# Altium project MIC23201 Atmel Support.PrjPcb
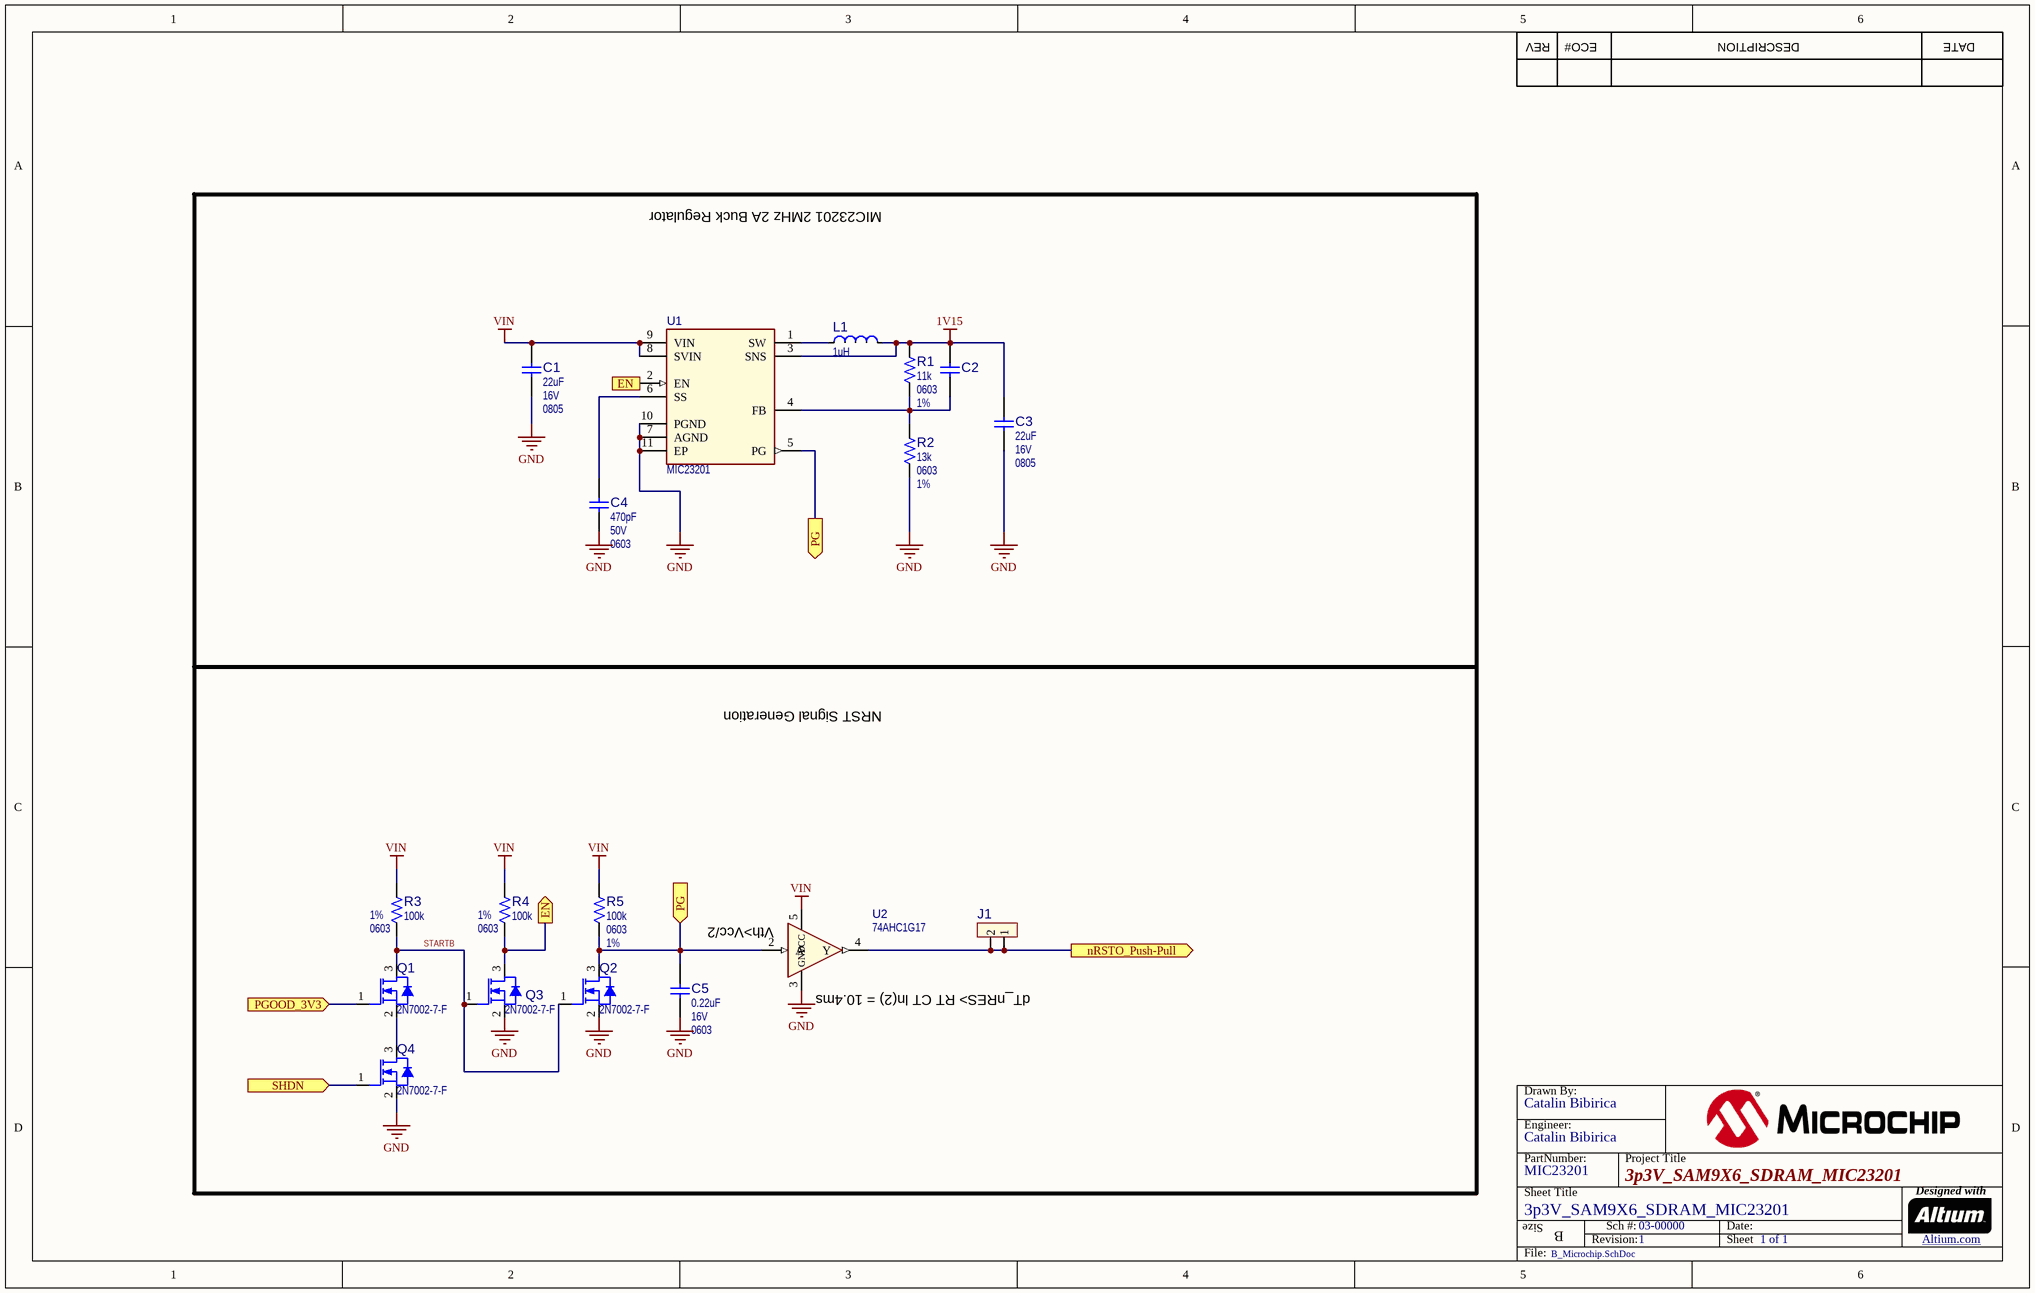
[diagram p0: B_Microchip.SchDoc]
ProjectTitle: 3p3V_SAM9X6_SDRAM_MIC23201; ProjectRevisionSCH: 1; ProjectRevisionFAB: 1; ProjectRevisionASSY: 1; ProjectRevisionART: 1; ProjectPartNumber: MIC23201; ProjectEngineer: Catalin Bibirica; ProjectDrawnBy: Catalin Bibirica; ProjectBoardNumber: 00000
1 sheet, 19 parts. Net scope: flat (ports and power ports of the same name join across sheets).

## Sheet B_Microchip.SchDoc
size B; CompanyName: Microchip Technology Inc.; Organization: Microchip Technology; Address1: 2355 West Chandler Blvd.; Address2: Chandler, AZ  85224; Address4: USA; DocumentNumber: 1; SheetNumber: 1; SheetTotal: 1; SheetTitle: 3p3V_SAM9X6_SDRAM_MIC23201; Time: Time

### Parts
?  (no value)  (graphical)
C1  value 22uF  Voltage: 16V  Package: 0805  [CAP_C_0805]  (hidden comment: Capacitor NP)
C2  Capacitor NP  [CAP_C_0603]  (value not drawn)
C3  value 22uF  Voltage: 16V  Package: 0805  [CAP_C_0805]  (hidden comment: Capacitor NP)
C4  value 470pF  Voltage: 50V  Package: 0603  [CAP_C_0603]  (hidden comment: Capacitor NP)
C5  value 0.22uF  Voltage: 16V  Package: 0603  [CAP_C_0603]  (hidden comment: Capacitor NP)
J1  Header 1x2  [HDR_M_2.54_1x2]  (value not drawn)
L1  value 1uH  [IND_C_2520]  (hidden comment: Inductor)
Q1  value 2N7002-7-F  [SOT-23-3]  (hidden comment: Transistor MOS-N GSD)
Q2  value 2N7002-7-F  [SOT-23-3]  (hidden comment: Transistor MOS-N GSD)
Q3  value 2N7002-7-F  [SOT-23-3]  (hidden comment: Transistor MOS-N GSD)
Q4  value 2N7002-7-F  [SOT-23-3]  (hidden comment: Transistor MOS-N GSD)
R1  value 11k  Package: 0603  Tolerance: 1%  [RES_C_0603]  (hidden comment: Resistor)
R2  value 13k  Package: 0603  Tolerance: 1%  [RES_C_0603]  (hidden comment: Resistor)
R3  value 100k  Package: 0603  Tolerance: 1%  [RES_C_0603]  (hidden comment: Resistor)
R4  value 100k  Package: 0603  Tolerance: 1%  [RES_C_0603]  (hidden comment: Resistor)
R5  value 100k  Package: 0603  Tolerance: 1%  [RES_C_0603]  (hidden comment: Resistor)
U1  value MIC23201  [MLF-10_3x3_1.6X2.5]  (hidden comment: MIC23201 MLF-10)
U2  value 74AHC1G17  [SC-70-5]  (hidden comment: 74AHC1G17 TSSOP5)

### Ports
EN (in), EN (out), nRSTO_Push-Pull (out), PG (in), PG (out), PGOOD_3V3 (in), SHDN (in)

### Nets
1V15: C2.2 C3.2 L1.2(F) R1.2 U1.3(SNS)
GND: C1.1 C3.1 C4.1 C5.1 Q2.2(S) Q3.2(S) Q4.2(S) R2.1 U1.7(AGND) U1.10(PGND) U1.11(EP) U2.3(GND)
VIN: C1.2 R3.1 R4.1 R5.2 U1.8(SVIN) U1.9(VIN) U2.5(VCC)
EN: Q3.3(D) R4.2 U1.2(EN) ; port EN
nRSTO_Push-Pull: J1.1 J1.2 U2.4(Y) ; port nRSTO_Push-Pull
PG: C5.2 Q2.3(D) R5.1 U1.5(PG) U2.2(A) ; port PG
PGOOD_3V3: Q1.1(G) ; port PGOOD_3V3
SHDN: Q4.1(G) ; port SHDN
STARTB: Q1.3(D) Q2.1(G) Q3.1(G) R3.2
NetC2_1: C2.1 R1.1 R2.2 U1.4(FB)
NetC4_2: C4.2 U1.6(SS)
NetL1_1: L1.1(S) U1.1(SW)
NetQ1_2: Q1.2(S) Q4.3(D)

Not connected (* = marked no-connect by the designer): U2 1(NC)

### Notes on the sheet
- REV
- ECO#
- DESCRIPTION
- DATE
- MIC23201 2MHz 2A Buck Regulator
- NRST Signal Generation
- (near U2) Vth>Vcc/2
- (near U2) dT_nRES> RT CT ln(2) = 10.4ms
- Drawn By:
- Engineer:
- PartNumber:
- Project Title
- Sheet Title
- Size
- B
- Revision:
- Sch #:
- Date:
- Sheet
- Designed with
- Altium.com <http://go.altium.com/MicrochipLandingPage_Evaluation.html>
- File:

### Library data of the parts
? = Title Block B
C1 C3 = CAP0627: Capacitor; Manufacturer 1: TDK; Manufacturer Part Number 1: C2012X5R1C226K; Description_: CAP CER 22uF 16V 10% X5R SMD 0805; Dev Tools Status: Production; Tolerance: 10%; Temperature Coeffcient: X5R; Type: Ceramic; Populated: Yes; MCHP-ID: CAP0627; Revision: 1; Symbol: Capacitor NP; Status: MCL Design; ComponentLink1URL: https://chn-vm-apps.microchip.com/mchprepo/parts/Datasheets/general_B11.pdf; ComponentLink1Description: SVN Datasheet; ComponentLink2URL: C:\ALTIUM_WORK\00001_MCHP-CDB\Datasheets\general_B11.pdf; ComponentLink2Description: Local Datasheet; ComponentLink3URL: C:\ALTIUM_WORK\00001_MCHP-CDB\Library\LibraryRefs\Capacitor NP.SchLib; ComponentLink3Description: Open Symbol; ComponentLink4URL: C:\ALTIUM_WORK\00001_MCHP-CDB\Library\Footprints\CAP_C_0805.PcbLib; ComponentLink4Description: Open Footprint; ComponentLink5Description: Open Footprint 2; ComponentLink6Description: Open Footprint 3; ComponentLink7Description: Open Footprint 4; Operating Temperature: -55C to +85C; Category: Capacitor; Supplier 1: Digi-Key; Supplier Part Number 1: 445-6797-2-ND; Quantity Override: 1
C2 = CAP0521: Capacitor; Manufacturer 1: Murata; Manufacturer Part Number 1: GRM1885C1H680JA01D; Value: 68pF; Voltage: 50V; Description_: CAP CER 68pF 50V 5% C0G SMD 0603; Dev Tools Status: Production; Tolerance: 5%; Temperature Coeffcient: C0G; Type: Ceramic; Populated: Yes; MCHP-ID: CAP0521; Package: 0603; Revision: 1; Symbol: Capacitor NP; Status: MCL Design; ComponentLink1URL: https://chn-vm-apps.microchip.com/mchprepo/parts/Datasheets/L0005E.pdf; ComponentLink1Description: SVN Datasheet; ComponentLink2URL: C:\ALTIUM_WORK\00001_MCHP-CDB\Datasheets\L0005E.pdf; ComponentLink2Description: Local Datasheet; ComponentLink3URL: C:\ALTIUM_WORK\00001_MCHP-CDB\Library\LibraryRefs\Capacitor NP.SchLib; ComponentLink3Description: Open Symbol; ComponentLink4URL: C:\ALTIUM_WORK\00001_MCHP-CDB\Library\Footprints\CAP_C_0603.PcbLib; ComponentLink4Description: Open Footprint; ComponentLink5Description: Open Footprint 2; ComponentLink6Description: Open Footprint 3; ComponentLink7Description: Open Footprint 4; Operating Temperature: +25C to +125C; Category: Capacitor; Supplier 1: Digi-Key; Supplier Part Number 1: 490-1423-2-ND; Quantity Override: 1
C4 = CAP0408: Capacitor; Manufacturer 1: Johanson Dielectrics; Manufacturer Part Number 1: 500R14W471KV4T; Description_: CAP CER 470pF 50V 10% X7R SMD 0603; Dev Tools Status: Production; Tolerance: 10%; Temperature Coeffcient: X7R; Type: Ceramic; Populated: Yes; MCHP-ID: CAP0408; Revision: 1; Symbol: Capacitor NP; Status: MCL Design; ComponentLink1URL: https://chn-vm-apps.microchip.com/mchprepo/parts/Datasheets/JDI_Surface-Mount_2012-01.pdf; ComponentLink1Description: SVN Datasheet; ComponentLink2URL: C:\ALTIUM_WORK\00001_MCHP-CDB\Datasheets\JDI_Surface-Mount_2012-01.pdf; ComponentLink2Description: Local Datasheet; ComponentLink3URL: C:\ALTIUM_WORK\00001_MCHP-CDB\Library\LibraryRefs\Capacitor NP.SchLib; ComponentLink3Description: Open Symbol; ComponentLink4URL: C:\ALTIUM_WORK\00001_MCHP-CDB\Library\Footprints\CAP_C_0603.PcbLib; ComponentLink4Description: Open Footprint; ComponentLink5Description: Open Footprint 2; ComponentLink6Description: Open Footprint 3; ComponentLink7Description: Open Footprint 4; Operating Temperature: -55C to +125C; Category: Capacitor; Manufacturer 2: Murata; Manufacturer Part Number 2: GRM188R71H471KA01D; Manufacturer 3: Yageo; Manufacturer Part Number 3: CC0603KRX7R9BB471; Supplier 1: Digi-Key; Supplier Part Number 1: 709-1164-1-ND; Supplier 2: Digi-Key; Supplier Part Number 2: 490-1489-1-ND; Supplier 3: Digi-Key; Supplier Part Number 3: 311-1078-2-ND; Quantity Override: 1
C5 = CAP0191: Capacitor; Manufacturer 1: KEMET; Manufacturer Part Number 1: C0603C224Z4VACTU; Description_: CAP CER 0.22uF 16V 20% Y5V SMD 0603; Dev Tools Status: Production; Tolerance: 20%; Temperature Coeffcient: Y5V; Type: Ceramic; Populated: Yes; MCHP-ID: CAP0191; Revision: 1; Symbol: Capacitor NP; Status: MCL Design; ComponentLink1URL: https://chn-vm-apps.microchip.com/mchprepo/parts/Datasheets/KEM_C1002_X7R_SMD.pdf; ComponentLink1Description: SVN Datasheet; ComponentLink2URL: C:\ALTIUM_WORK\00001_MCHP-CDB\Datasheets\KEM_C1002_X7R_SMD.pdf; ComponentLink2Description: Local Datasheet; ComponentLink3URL: C:\ALTIUM_WORK\00001_MCHP-CDB\Library\LibraryRefs\Capacitor NP.SchLib; ComponentLink3Description: Open Symbol; ComponentLink4URL: C:\ALTIUM_WORK\00001_MCHP-CDB\Library\Footprints\CAP_C_0603.PcbLib; ComponentLink4Description: Open Footprint; ComponentLink5Description: Open Footprint 2; ComponentLink6Description: Open Footprint 3; ComponentLink7Description: Open Footprint 4; Operating Temperature: -55C to +125C; Category: Capacitor; Manufacturer 2: Panasonic; Manufacturer Part Number 2: ECJ-1VF1C224Z; Supplier 1: Digi-Key; Supplier Part Number 1: 399-1102-1-ND; Supplier 2: Digi-Key; Supplier Part Number 2: PCC1790TR-ND; Quantity Override: 1
J1 = CON1108: Manufacturer 1: FCI; Manufacturer Part Number 1: 77311-118-02LF; Description_: CON HDR-2.54 Male 1x2 Gold 5.84MH TH VERT; Dev Tools Status: Production; Owner: Bogdan P (M91398); Populated: Yes; MCHP-ID: CON1108; Revision: 1; Symbol: Header 1x2; Status: MCL Design; ComponentLink1URL: https://chn-vm-apps.microchip.com/mchprepo/parts/Datasheets/77311.pdf; ComponentLink1Description: SVN Datasheet; ComponentLink2URL: C:\ALTIUM_WORK\00001_MCHP-CDB\Datasheets\77311.pdf; ComponentLink2Description: Local Datasheet; ComponentLink3URL: C:\ALTIUM_WORK\00001_MCHP-CDB\Library\LibraryRefs\Header 1x2.SchLib; ComponentLink3Description: Open Symbol; ComponentLink4URL: C:\ALTIUM_WORK\00001_MCHP-CDB\Library\Footprints\HDR_M_2.54_1x2.PcbLib; ComponentLink4Description: Open Footprint; ComponentLink5Description: Open Footprint 2; ComponentLink6Description: Open Footprint 3; ComponentLink7Description: Open Footprint 4; Type: Header 2.54mm; Category: Connector; Manufacturer 2: FCI; Manufacturer Part Number 2: 68001-202HLF; Manufacturer 3: FCI; Manufacturer Part Number 3: 68000-202HLF; Manufacturer 4: Samtec; Manufacturer Part Number 4: TSW-102-07-G-S; Manufacturer 5: Sullins; Manufacturer Part Number 5: PBC02SAAN; Manufacturer 6: SPC Technology; Manufacturer Part Number 6: SPC20481; Manufacturer 7: Samtec; Manufacturer Part Number 7: TSW-102-07-F-S; Manufacturer 8: Nextron; Manufacturer Part Number 8: R-211-0211-0021-000; Manufacturer 9: Samtec; Manufacturer Part Number 9: TSW-102-07-S-S; Supplier 1: Digi-Key; Supplier Part Number 1: 609-4434-ND; Supplier 2: Digi-Key; Supplier Part Number 2: 609-3469-ND; Supplier 3: Digi-Key; Supplier Part Number 3: 609-3502-ND; Supplier 4: Digi-Key; Supplier Part Number 4: SAM1029-02-ND; Supplier 5: Digi-Key; Supplier Part Number 5: S1011E-02-ND; Supplier 6: Newark; Supplier Part Number 6: 93K5734; Supplier 7: Newark; Supplier Part Number 7: 79P3146; Supplier 8: Raynen; Supplier Part Number 8: R-211-0211-0021-000; Supplier 9: Samtec; Supplier Part Number 9: TSW-102-07-S-S; Quantity Override: 1
L1 = IND1326: Manufacturer 1: TDK; Manufacturer Part Number 1: MLP2520W1R0MT0S1; Description_: INDUCTOR 1uH 2.3A 20% SMD 2520; Dev Tools Status: Production; Owner: Razvan Cristescu; DCR: 0.062R; RMS Current: 2.3A; Test Frequency: 2MHz; Populated: YES; MCHP-ID: IND1326; Revision: 1; Symbol: Inductor; Status: MCL Design; ComponentLink1URL: https://chn-vm-apps.microchip.com/mchprepo/parts/Datasheets/inductor_commercial_power_mlp2520_en.pdf; ComponentLink1Description: SVN Datasheet; ComponentLink2URL: C:\ALTIUM_WORK\00001_MCHP-CDB\Datasheets\inductor_commercial_power_mlp2520_en.pdf; ComponentLink2Description: Local Datasheet; ComponentLink3URL: C:\ALTIUM_WORK\00001_MCHP-CDB\Library\LibraryRefs\Inductor.SchLib; ComponentLink3Description: Open Symbol; ComponentLink4URL: C:\ALTIUM_WORK\00001_MCHP-CDB\Library\Footprints\IND_C_2520.PcbLib; ComponentLink4Description: Open Footprint; ComponentLink5Description: Open Footprint 2; ComponentLink6Description: Open Footprint 3; ComponentLink7Description: Open Footprint 4; Operating Temperature: -40C to +125C; Package: 2520; Type: Inductor; Category: Inductor; Manufacturer 2: TDK Corporation; Manufacturer Part Number 2: MLP2520W1R0MT0S1; Supplier 1: Mouser; Supplier Part Number 1: 810-MLP2520W1R0MT0S1; Supplier 2: Digi-Key; Supplier Part Number 2: MLP2520W1R0MT0S1-ND; Quantity Override: 1
Q1-Q4 = TRA1102: Transistor MOS; Manufacturer 1: Diodes Inc; Description_: TRANS FET N-CH 2N7002-7-F 60V 170mA 370mW SOT-23-3; Dev Tools Status: Production; Type: FET; Current: 170mA; Drain to Source Voltage: 60V; Gate to Source Voltage: 20V; Power: 370mW; Owner: Adrian M (M91404); Populated: YES; MCHP-ID: TRA1102; Revision: 0; Symbol: Transistor MOS-N GSD; Status: MCL Design; Package: SOT-23-3; ComponentLink1URL: https://chn-vm-apps.microchip.com/mchprepo/parts/Datasheets/ds11303.pdf; ComponentLink1Description: Datasheet; Operating Temperature: -55C to +150C; Category: Transistor; Manufacturer Part Number 1: 2N7002-7-F; Supplier 1: Digi-Key; Supplier Part Number 1: 2N7002-FDICT-ND; Quantity Override: 1
R1 = RSMT0550: Manufacturer 1: Panasonic; Manufacturer Part Number 1: ERJ-3EKF1102V; Description_: RES TKF 11k 1% 1/10W SMD 0603; Dev Tools Status: Production; Voltage: 75V; Temperature Coeffcient: 100ppm/C; Power: 1/10W; Populated: Yes; MCHP-ID: RSMT0550; Revision: 1; Symbol: Resistor; Status: MCL Design; ComponentLink1URL: https://chn-vm-apps.microchip.com/mchprepo/parts/Datasheets/AOA0000CE2.pdf; ComponentLink1Description: SVN Datasheet; ComponentLink2URL: C:\ALTIUM_WORK\00001_MCHP-CDB\Datasheets\AOA0000CE2.pdf; ComponentLink2Description: Local Datasheet; ComponentLink3URL: C:\ALTIUM_WORK\00001_MCHP-CDB\Library\LibraryRefs\Resistor.SchLib; ComponentLink3Description: Open Symbol; ComponentLink4URL: C:\ALTIUM_WORK\00001_MCHP-CDB\Library\Footprints\RES_C_0603.PcbLib; ComponentLink4Description: Open Footprint; ComponentLink5Description: Open Footprint 2; ComponentLink6Description: Open Footprint 3; ComponentLink7Description: Open Footprint 4; Operating Temperature: -55C to +155C; Category: Resistor; Type: RES SMD; Composition: TKF; Supplier 1: Digi-Key; Supplier Part Number 1: P11.0KHCT-ND; Quantity Override: 1
R2 = RES1121: Manufacturer 1: Panasonic; Manufacturer Part Number 1: ERJ-3EKF1302V; Description_: RES TKF 13k 1% 1/10W SMD 0603; Dev Tools Status: Production; Voltage: 75V; Temperature Coeffcient: 100ppm/C; Power: 1/10W; Owner: Mihai T(M91442); Populated: Yes; MCHP-ID: RES1121; Revision: 0; Symbol: Resistor; Status: MCL Design; ComponentLink1URL: https://chn-vm-apps.microchip.com/mchprepo/parts/Datasheets/AOA0000CE2.pdf; ComponentLink1Description: SVN Datasheet; ComponentLink2URL: C:\ALTIUM_WORK\00001_MCHP-CDB\Datasheets\AOA0000CE2.pdf; ComponentLink2Description: Local Datasheet; ComponentLink3URL: C:\ALTIUM_WORK\00001_MCHP-CDB\Library\LibraryRefs\Resistor.SchLib; ComponentLink3Description: Open Symbol; ComponentLink4URL: C:\ALTIUM_WORK\00001_MCHP-CDB\Library\Footprints\RES_C_0603.PcbLib; ComponentLink4Description: Open Footprint; ComponentLink5Description: Open Footprint 2; ComponentLink6Description: Open Footprint 3; ComponentLink7Description: Open Footprint 4; Operating Temperature: -55C to +155C; Category: Resistor; Type: RES SMD; Composition: TKF; Supplier 1: Digi-Key; Supplier Part Number 1: P13.0KHCT-ND; Supplier 2: Farnell; Supplier Part Number 2: 2059416; Quantity Override: 1
R3-R5 = RES1066: Manufacturer 1: Vishay; Manufacturer Part Number 1: MCT06030C1003FP500; Description_: RES TF 100k 1% 1/8W SMD 0603; Dev Tools Status: Production; Voltage: 75V; Temperature Coeffcient: 50ppm/C; Power: 1/8W; Owner: Tad Ahlvers; Populated: Yes; MCHP-ID: RES1066; Revision: 1; Symbol: Resistor; Status: MCL Design; ComponentLink1URL: https://chn-vm-apps.microchip.com/mchprepo/parts/Datasheets/mc_pro.pdf; ComponentLink1Description: Datasheet; Operating Temperature: -55C to +155C; Category: Resistor; Type: RES SMD; Composition: TF; Supplier 1: Digi-Key; Supplier Part Number 1: MCT0603-100K-CFTR-ND; Quantity Override: 1
U1 = MIC7256: Manufacturer 1: Microchip Technology; Manufacturer Part Number 1: MIC23201YML-TR; Description_: MCHP ANALOG SWITCHER Buck 0.95V to 3.6V 2A MIC23201YML-TR MLF-10; MAPS Description: 2MHz PWM 2A Buck Regulator with HSC; Dev Tools Status: Production; Owner: Sam Charles; MPC: 22830YJFAA02; LeadContent: Pb-FREE; PackingMedia: T/R; Stage: REL; LeadCount: 10; PackageWidth: 3x3x0.9mm; ForceMinOrderQtyMult: True; MinOrderQty: 1; TempRange: -40C to +125C; tblDeviceFamilyID: 7698; InputVoltageRangeMin: 2.7; InputVoltageRangeMax: 5.5; VoutMin: 0.62; VoutMax: 3.6; QuiescentCurrent: 1.15; SwitchingFrequency: 2000; Populated: YES; MCHP-ID: MIC7256; Symbol: MIC23201 MLF-10; Type: Switcher; Status: MCL Design; Revision: 1; Category: MCHP-Analog; ComponentLink1URL: http://www.microchip.com/wwwproducts/MIC23201; ComponentLink1Description: SVN Datasheet; ComponentLink2URL: C:\ALTIUM_WORK\00001_MCHP-CDB\Datasheets\MIC23201.pdf; ComponentLink2Description: Local Datasheet; ComponentLink3URL: C:\ALTIUM_WORK\00001_MCHP-CDB\Library\LibraryRefs\MIC23201 MLF-10.SchLib; ComponentLink3Description: Open Symbol; ComponentLink4URL: C:\ALTIUM_WORK\00001_MCHP-CDB\Library\Footprints\MLF-10_3x3_1.6X2.5.PcbLib; ComponentLink4Description: Open Footprint; ComponentLink5Description: Open Footprint 2; ComponentLink6Description: Open Footprint 3; ComponentLink7Description: Open Footprint 4; Supplier 1: Digi-Key; Supplier Part Number 1: 576-4159-1-ND; IntroductionDate: 2012-10-25; PackageType: VDFN; Quantity Override: 1
U2 = IC1595: Manufacturer 1: Nexperia USA Inc.; Manufacturer Part Number 1: 74AHC1G17GWH; MCHP-ID: IC1595; Description_: IC BUFFER Schmitt trigger 74AHC1G17GW GATE SGL CMOS SC-70-5; Dev Tools Status: Design; Vin: +2V to +5.5V; Owner: Cristian Papuc; Populated: YES; Revision: A; Symbol: 74AHC1G17 TSSOP5; Status: MCL Design; Package: SC-70-5; ComponentLink1URL: https://chn-vm-apps.microchip.com/mchprepo/parts/Datasheets/74AHC_AHCT1G17.pdf; ComponentLink1Description: SVN Datasheet; ComponentLink2URL: C:\ALTIUM_WORK\00001_MCHP-CDB\Datasheets\74AHC_AHCT1G17.pdf; ComponentLink2Description: Local Datasheet; ComponentLink3URL: C:\ALTIUM_WORK\00001_MCHP-CDB\Library\LibraryRefs\74AHC1G17 TSSOP5.SchLib; ComponentLink3Description: Open Symbol; ComponentLink4URL: C:\ALTIUM_WORK\00001_MCHP-CDB\Library\Footprints\SC-70-5.PcbLib; ComponentLink4Description: Open Footprint; ComponentLink5Description: Open Footprint 2; ComponentLink6Description: Open Footprint 3; ComponentLink7Description: Open Footprint 4; Operating Temperature: -40C to +125C; Type: Buffer; Category: IC; Supplier 1: Digi-Key; Supplier Part Number 1: 1727-7851-1-ND; Quantity Override: 1